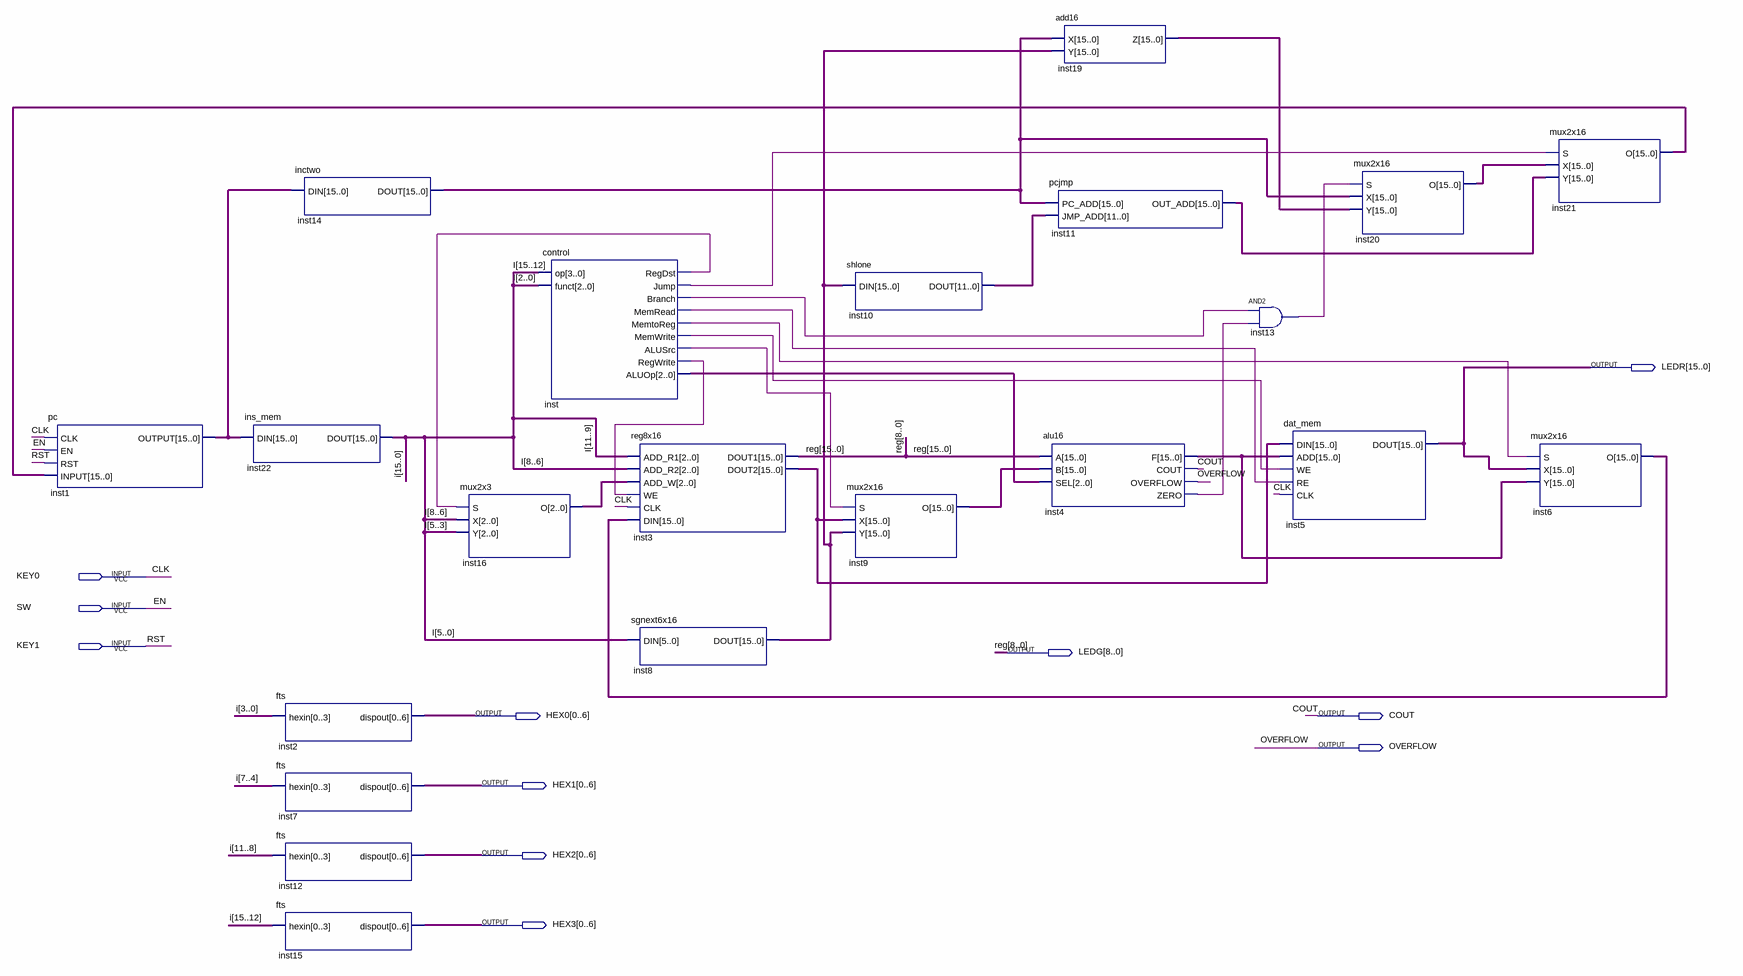
[diagram p0: schematic sheet]
// Quartus schematic m16dp.bdf as structural Verilog: 21 symbols, 11 pins
module m16dp (
  input  KEY0,
  input  SW,
  input  KEY1,
  output [15:0] LEDR,
  output [8:0] LEDG,
  output [0:6] HEX0,
  output COUT,
  output OVERFLOW,
  output [0:6] HEX1,
  output [0:6] HEX2,
  output [0:6] HEX3
);

  wire inst4_zero, inst13_out, inst_alusrc, inst_branch, inst_jump, inst_memread, inst_memtoreg,
       inst_memwrite, inst_regdst, inst_regwrite;
  wire [2:0] inst16_o, inst_aluop;
  wire [11:0] inst10_dout;
  wire [15:0] I, inst1_output, inst3_dout2, inst4_f, inst6_o, inst8_dout, inst9_o, inst11_out_add,
       inst14_dout, inst19_z, inst20_o, inst21_o;
  wire [15:9] \reg ;

  pc inst1 (.CLK(KEY0), .EN(SW), .RST(KEY1), .INPUT(inst21_o), .OUTPUT(inst1_output));
  ins_mem inst22 (.DIN(inst1_output), .DOUT(I));
  fts inst2 (.hexin(I[3:0]), .dispout(HEX0));
  fts inst7 (.hexin(I[7:4]), .dispout(HEX1));
  fts inst12 (.hexin(I[11:8]), .dispout(HEX2));
  fts inst15 (.hexin(I[15:12]), .dispout(HEX3));
  inctwo inst14 (.DIN(inst1_output), .DOUT(inst14_dout));
  mux2x3 inst16 (.S(inst_regdst), .X(I[8:6]), .Y(I[5:3]), .O(inst16_o));
  control inst (
    .op(I[15:12]), .funct(I[2:0]), .RegDst(inst_regdst), .Jump(inst_jump), .Branch(inst_branch),
    .MemRead(inst_memread), .MemtoReg(inst_memtoreg), .MemWrite(inst_memwrite), .ALUSrc(inst_alusrc),
    .RegWrite(inst_regwrite), .ALUOp(inst_aluop));
  reg8x16 inst3 (
    .ADD_R1(I[11:9]), .ADD_R2(I[8:6]), .ADD_W(inst16_o), .WE(inst_regwrite), .CLK(KEY0), .DIN(inst6_o),
    .DOUT1({\reg , LEDG}), .DOUT2(inst3_dout2));
  sgnext6x16 inst8 (.DIN(I[5:0]), .DOUT(inst8_dout));
  shlone inst10 (.DIN(inst8_dout), .DOUT(inst10_dout));
  mux2x16 inst9 (.S(inst_alusrc), .X(inst3_dout2), .Y(inst8_dout), .O(inst9_o));
  pcjmp inst11 (.PC_ADD(inst14_dout), .JMP_ADD(inst10_dout), .OUT_ADD(inst11_out_add));
  alu16 inst4 (
    .A({\reg , LEDG}), .B(inst9_o), .SEL(inst_aluop), .F(inst4_f), .COUT(COUT), .OVERFLOW(OVERFLOW),
    .ZERO(inst4_zero));
  add16 inst19 (.X(inst14_dout), .Y(inst8_dout), .Z(inst19_z));
  and inst13 (inst13_out, inst_branch, inst4_zero);
  dat_mem inst5 (.DIN(inst3_dout2), .ADD(inst4_f), .WE(inst_memwrite), .RE(inst_memread), .CLK(KEY0), .DOUT(LEDR));
  mux2x16 inst20 (.S(inst13_out), .X(inst14_dout), .Y(inst19_z), .O(inst20_o));
  mux2x16 inst21 (.S(inst_jump), .X(inst20_o), .Y(inst11_out_add), .O(inst21_o));
  mux2x16 inst6 (.S(inst_memtoreg), .X(LEDR), .Y(inst4_f), .O(inst6_o));

  // Other names for the same wires on the sheet: CLK = KEY0; EN = SW; reg[8:0] = LEDG; RST = KEY1
endmodule
